# EAGLE design chandni-chhabra_week10_02- (EAGLE 8.0.2)
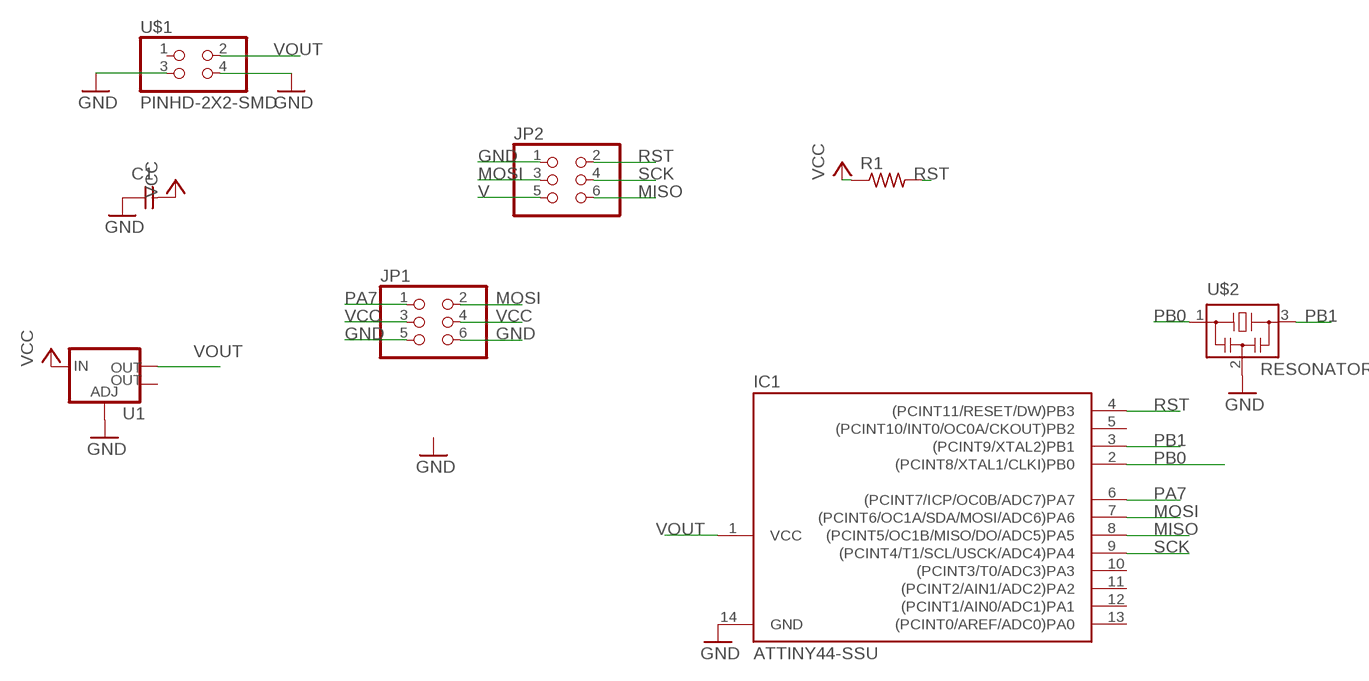
[diagram p0: schematic, sheet 1]

## Parts
C1  CAP-UNPOLARIZEDFAB  [C1206FAB]
IC1  ATTINY44-SSU  [SOIC14]
JP1  PINHD-2X3-SMD  [2X03SMD]
JP2  PINHD-2X3-SMD  [2X03SMD]
R1  RES-US1206FAB  [R1206FAB]
U1  V_REG_LM1117SOT223  [SOT223]
U$1  PINHD-2X2-SMD  [2X02SMD]
U$2  RESONATOR  [EFOBM]

## Nets
GND: C1.1 IC1.14(GND) JP1.5 JP1.6 JP2.1 U1.1(ADJ) U$1.3 U$1.4 U$2.2
MISO: IC1.8((PCINT5/OC1B/MISO/DO/ADC5)PA5) JP2.6
MOSI: IC1.7((PCINT6/OC1A/SDA/MOSI/ADC6)PA6) JP1.2 JP2.3
PA7: IC1.6((PCINT7/ICP/OC0B/ADC7)PA7) JP1.1
PB0: IC1.2((PCINT8/XTAL1/CLKI)PB0) U$2.1
PB1: IC1.3((PCINT9/XTAL2)PB1) U$2.3
RST: IC1.4((PCINT11/RESET/DW)PB3) JP2.2 R1.2
SCK: IC1.9((PCINT4/T1/SCL/USCK/ADC4)PA4) JP2.4
V: JP2.5
VCC: C1.2 JP1.3 JP1.4 R1.1 U1.3(IN)
VOUT: IC1.1(VCC) U1.2(OUT) U$1.2
Unconnected: IC1.5((PCINT10/INT0/OC0A/CKOUT)PB2) IC1.10((PCINT3/T0/ADC3)PA3) IC1.11((PCINT2/AIN1/ADC2)PA2) IC1.12((PCINT1/AIN0/ADC1)PA1) IC1.13((PCINT0/AREF/ADC0)PA0) U1.4(OUT) U$1.1

## Library data of the parts
C1 = fab:CAP-UNPOLARIZED
IC1 = fab:ATTINY44
JP1 JP2 = fab:PINHD-2X3-SMD: PIN HEADER
R1 = fab:RES-US: Resistor (US Symbol) Variants with postfix FAB are widened to allow the routing of internal traces
U1 = fab:V_REG_LM1117: Voltage Regulator LM1117 Standard adjustable voltage regulator but in SMD form. Spark Fun Electronics SKU : COM-00595; PROD_ID: VREG-08170
U$1 = fab:PINHD-2X2-SMD
U$2 = fab:RESONATOR

## Net classes
0 default: width 0.04 mm, clearance 0.4 mm

## Board
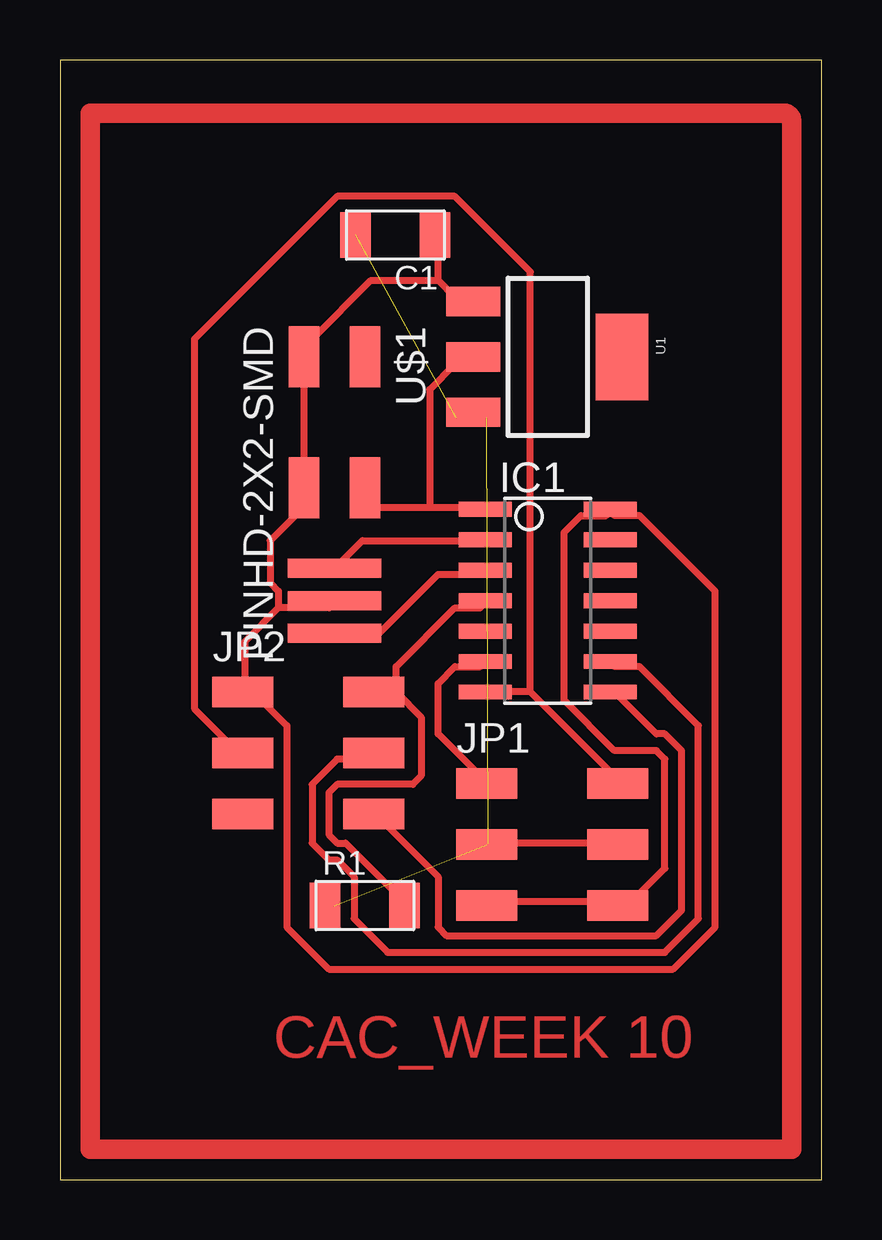
[diagram p1: board, top side]

Size 31.73 x 46.66 mm. Coordinates in mm from the lower left corner, seen from the top.
Outline: 0,0 31.73,0 31.73,46.66 0,46.66 0,0
Copper layers (1*16): Top 0.035mm / dielectric 1.5mm / Bottom 0.035mm
Design rules "fab *": minimum track width 0.3mm, minimum drill 32mil, track to track 0.4mm, track to pad 0.315mm, pad to pad 0.315mm, via to via 0.315mm, smd to smd 0.315mm, copper to edge 40mil, drill to drill 16mil, minimum pad ring 10mil, minimum via ring 8mil, stop-mask expansion 4mil, vias tented up to drill 0mil, thermal gap 10mil

### Footprints (pad centres in the part's own frame; a part is rotated, then mirrored left to right if it is on the bottom)
C1206FAB = smd 1.27 x 1.905: 1 -1.651,0; 2 1.651,0
SOIC14 = smd 0.61 x 2.21: 1 -3.81,-2.603; 2 -2.54,-2.603; 3 -1.27,-2.603; 4 0,-2.603; 5 1.27,-2.603; 6 2.54,-2.603; 7 3.81,-2.603; 8 3.81,2.603; 9 2.54,2.603; 10 1.27,2.603; 11 0,2.603; 12 -1.27,2.603; 13 -2.54,2.603; 14 -3.81,2.603
2X03SMD = smd 2.54 x 1.27: 1 -2.54,2.54; 2 2.92,2.54; 3 -2.54,0; 4 2.92,0; 5 -2.54,-2.54; 6 2.92,-2.54
R1206FAB = smd 1.27 x 1.905: 1 -1.651,0; 2 1.651,0
SOT223 = smd 1.219 x 2.235: 1 -2.311,-3.099; 2 0,-3.099; 3 2.311,-3.099 | smd 3.6 x 2.2: 4 0,3.099
2X02SMD = smd 2.54 x 1.27: 1 -2.54,1.27; 2 2.92,1.27; 3 -2.54,-1.27; 4 2.92,-1.27
EFOBM = smd 0.8 x 3.9: 1 -1.35,0; 2 0,0; 3 1.35,0

### Placement (x,y rotation side)
C1  13.97,39.37 180 top
IC1  20.32,24.13 270 top
JP1  20.32,13.97 0 top
JP2  10.16,17.78 0 top
R1  12.7,11.43 0 top
U1  20.32,34.29 270 top
U$1  11.43,31.75 270 top
U$2  11.43,24.13 270 top

### Tracks (layer width: path | path; a pad name or v marks a point on that pad's centre or on a via)
GND
  Top 0.3: 24.13,11.43 JP1.6 | 16.51,36.83 U1.1 16.45,36.78 15.75,37.48 | 10.16,27.94 U$1.4 | 22.86,27.94 IC1.14 | IC1.14 22.75,27.68 21.7,27.68 21,26.98 21,19.98 23.1,17.88 24.85,17.88 25.2,17.53 25.2,12.98 23.45,11.23 JP1.6 | JP1.5 17.85,11.58 23.1,11.58 JP1.6 | 7.7,20.68 7.7,22.43 9.1,23.83 | 7.7,20.68 7.7,20.33 JP2.1 7.7,20.68 | 9.1,23.83 11.2,23.83 U$2.2 | 15.75,37.48 15.75,39.23 C1.1 | 15.75,37.48 12.95,37.48 10.5,35.03 10.5,34.33 U$1.3 10.15,33.98 10.15,29.08 U$1.4 | 9.1,23.83 9.1,24.53 8.75,24.88 8.75,26.63 10.15,28.03 U$1.4 | 7.7,20.68 9.45,18.93 9.45,10.53 11.2,8.78 25.55,8.78 27.3,10.53 27.3,24.53 24.15,27.68 23.1,27.68 IC1.14
MISO
  Top 0.3: IC1.8 23.1,20.33 24.85,18.58 25.2,18.58 25.9,17.88 25.9,11.23 24.85,10.18 16.1,10.18 15.75,10.53 15.75,12.63 13.3,15.08 JP2.6
MOSI
  Top 0.3: 19.6,20.33 17.85,20.33 IC1.7 | 19.6,20.33 23.1,16.83 JP1.2 | 19.6,20.33 19.6,37.83 16.45,40.98 11.55,40.98 5.6,35.03 5.6,19.63 7.35,17.88 JP2.3
N$1
  Top 0.813: 1.27,44.45 30.16,44.45 arc-90 30.48,44.13 30.48,1.27 1.27,1.27 1.27,44.45
PA7
  Top 0.3: 17.78,21.59 IC1.6 17.5,21.38 16.45,21.38 15.75,20.68 15.75,18.58 17.5,16.83 JP1.1
PB0
  Top 0.3: 17.78,26.67 IC1.2 17.5,26.63 12.6,26.63 11.55,25.58 U$2.1
PB1
  Top 0.3: 17.78,25.4 IC1.3 17.5,25.23 15.75,25.23 13.3,22.78 U$2.3 11.43,22.86
RST
  Top 0.3: 17.78,24.13 IC1.4 17.5,23.83 16.45,23.83 14,21.38 14,20.33 | 13.97,20.32 JP2.2 14,20.33 | 14,20.33 15.05,19.28 15.05,16.83 14.7,16.48 11.55,16.48 11.2,16.13 11.2,14.38 11.55,14.03 11.9,14.03 14.35,11.58 R1.2
SCK
  Top 0.3: IC1.9 23.1,21.38 24.15,21.38 26.6,18.93 26.6,10.88 25.2,9.48 13.65,9.48 12.25,10.88 12.25,12.63 11.55,13.33 11.2,13.33 10.5,14.03 10.5,16.48 11.55,17.53 12.95,17.53 JP2.4
VCC  (3 unrouted)
  Top 0.3: 16.51,31.75 U1.3 17.78,31.75 | 11.43,11.43 R1.1 | JP1.3 17.85,14.03 23.1,14.03 JP1.4
VOUT
  Top 0.3: 12.7,27.94 U$1.2 12.6,28.03 15.4,28.03 | 17.78,34.29 U1.2 17.15,33.98 16.45,33.98 15.4,32.93 15.4,28.03 | 17.78,27.94 IC1.1 17.5,28.03 15.4,28.03

### Text on the board
Top: CAC_WEEK 10